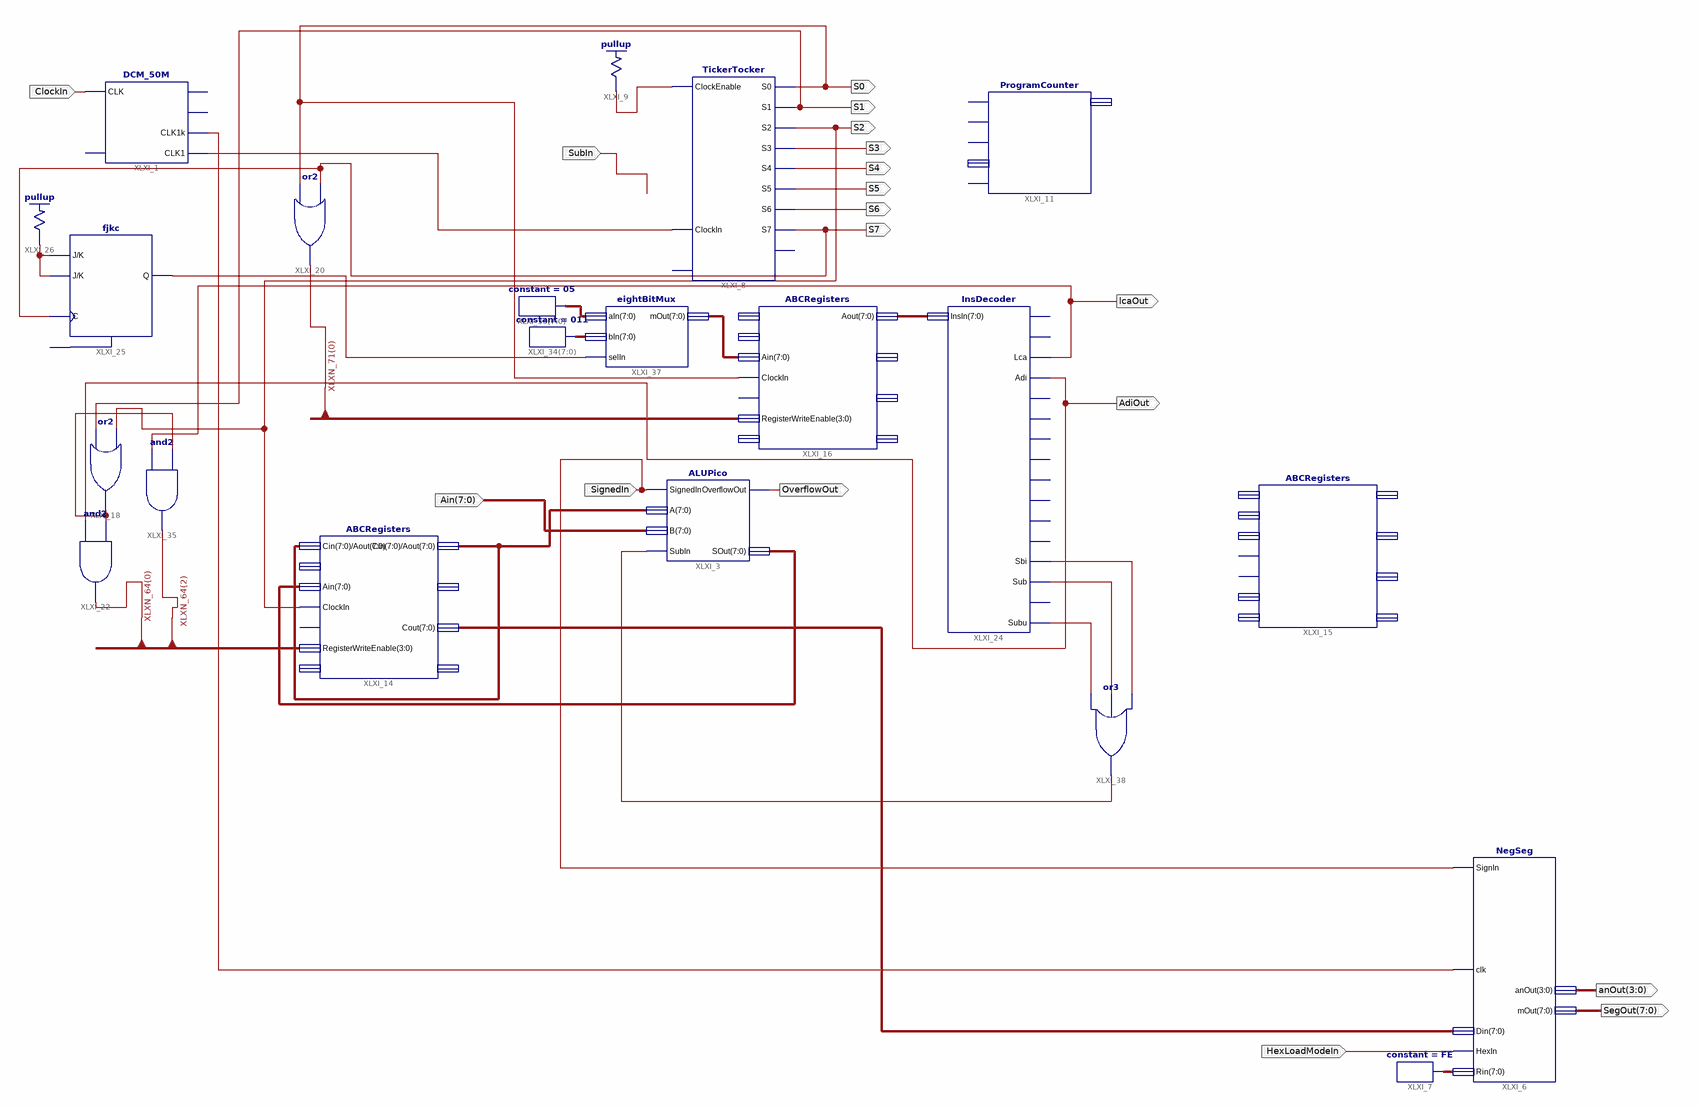
[diagram p0: schematic sheet 1]
// Xilinx ISE schematic TinyTester.sch (spartan3e) as structural Verilog: 21 symbols, 18 ports
module TinyTester (
  input  ClockIn,
  input  SignedIn,
  input  HexLoadModeIn,
  input  [7:0] Ain,
  input  SubIn,
  output [3:0] anOut,
  output [7:0] SegOut,
  output S0,
  output S1,
  output S2,
  output S3,
  output S4,
  output S5,
  output S6,
  output S7,
  output OverflowOut,
  output lcaOut,
  output AdiOut
);

  wire FlipCheckOut, XLXN_38, XLXN_52, XLXN_53, XLXN_86, XLXN_88, XLXN_122, XLXN_123, XLXN_124, XLXN_129;
  wire [3:0] XLXN_64, XLXN_71;
  wire [7:0] XLXN_43, XLXN_54, XLXN_56, XLXN_58, XLXN_87, XLXN_117, XLXN_118, XLXN_120;

  DCM_50M XLXI_1 (.CLK(ClockIn), .CLK1k(XLXN_38), .CLK1(XLXN_52));  // open: RST, CLK1M, CLK10k
  NegSeg XLXI_6 (
    .SignIn(SignedIn), .clk(XLXN_38), .Din(XLXN_58), .anOut(anOut), .mOut(SegOut), .HexIn(HexLoadModeIn),
    .Rin(XLXN_43));
  constant #(.CValue("FE")) XLXI_7 (.O(XLXN_43));
  TickerTocker XLXI_8 (
    .ClockEnable(XLXN_53), .ClockIn(XLXN_52), .S0(S0), .S1(S1), .S2(S2), .S3(S3), .S4(S4), .S5(S5), .S6(S6),
    .S7(S7));  // open: TickOut, ClearIn
  \pullup  XLXI_9 (.O(XLXN_53));
  ProgramCounter XLXI_11 ();  // open: ClockIn, ClearIn, ClockEnable, CountLoad, PushLoad, CounterOut
  ABCRegisters XLXI_15 ();  // open: Cin, Bin, Ain, ClockIn, ClrIn, RegisterWriteEnable, Din, Aout, Bout, Cout, Dout
  or XLXI_18 (XLXN_86, S1, S2);
  or XLXI_20 (XLXN_71[0], S0, S7);
  and XLXI_22 (XLXN_64[0], AdiOut, XLXN_86);
  fjkc XLXI_25 (.C(S7), .J(XLXN_88), .K(XLXN_88), .Q(FlipCheckOut));  // open: CLR
  \pullup  XLXI_26 (.O(XLXN_88));
  ALUPico XLXI_3 (
    .SignedIn(SignedIn), .A(XLXN_54), .B(Ain), .SubIn(XLXN_129), .OverflowOut(OverflowOut), .SOut(XLXN_56));
  ABCRegisters XLXI_14 (
    .Cin(XLXN_54), .Ain(XLXN_56), .ClockIn(S2), .RegisterWriteEnable(XLXN_64), .Aout(XLXN_54), .Cout(XLXN_58));  // open: Bin, ClrIn, Din, Bout, Dout
  ABCRegisters XLXI_16 (
    .Ain(XLXN_120), .ClockIn(S0), .RegisterWriteEnable(XLXN_71), .Aout(XLXN_87));  // open: Cin, Bin, ClrIn, Din, Bout, Cout, Dout
  InsDecoder XLXI_24 (
    .InsIn(XLXN_87), .Lca(lcaOut), .Adi(AdiOut), .Sbi(XLXN_122), .Sub(XLXN_123), .Subu(XLXN_124));  // open: Rst, Nop, Lda, Sta, Mvi, Clr, Set, Get, Add, Addu, Hlt
  constant #(.CValue("05")) XLXI_33[7:0] (.O(XLXN_118));
  constant #(.CValue("011")) XLXI_34[7:0] (.O(XLXN_117));
  and XLXI_35 (XLXN_64[2], lcaOut, XLXN_86);
  eightBitMux XLXI_37 (.aIn(XLXN_118), .bIn(XLXN_117), .selIn(FlipCheckOut), .mOut(XLXN_120));
  or XLXI_38 (XLXN_129, XLXN_124, XLXN_123, XLXN_122);
endmodule
